# EAGLE design vcf20 (EAGLE 9.5.2)
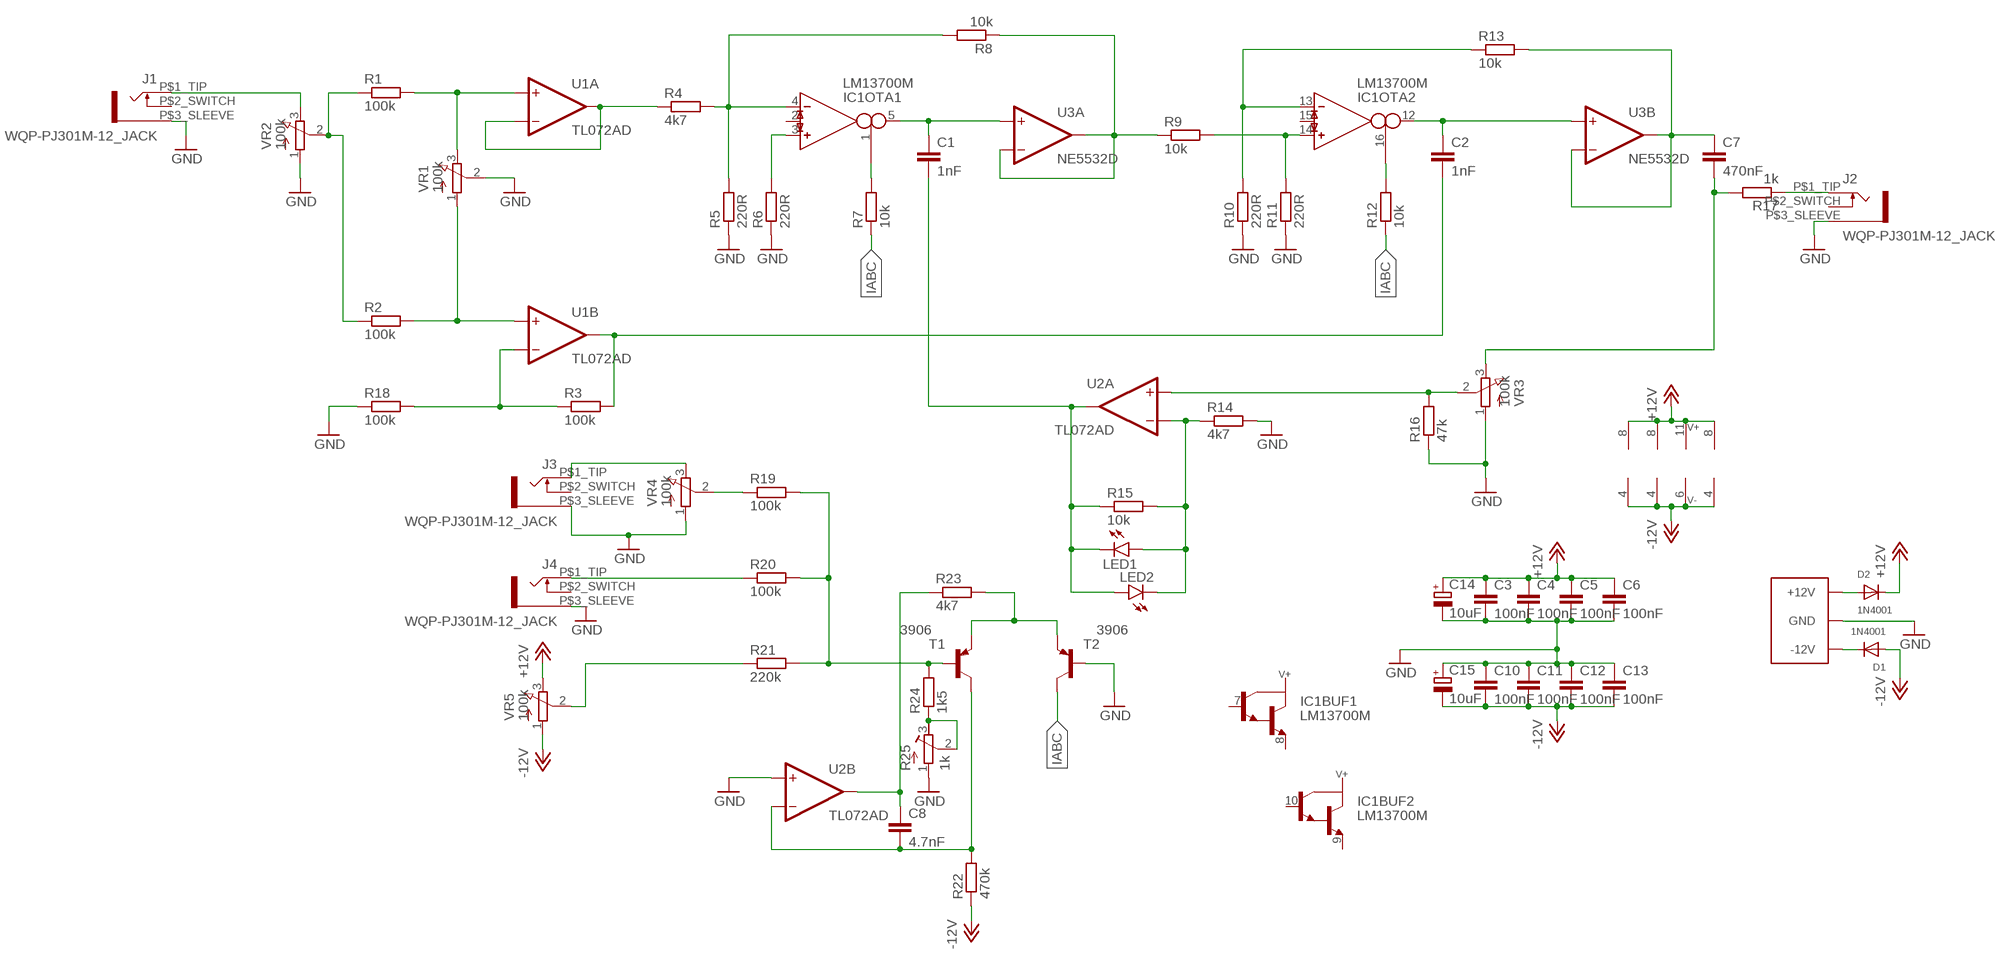
[diagram p0: schematic, sheet 1]

## Parts
C1  1nF  C-EUC0402  [C0402]
C2  1nF  C-EUC0402  [C0402]
C3  100nF  C-EUC0402  [C0402]
C4  100nF  C-EUC0402  [C0402]
C5  100nF  C-EUC0402  [C0402]
C6  100nF  C-EUC0402  [C0402]
C7  470nF  C-EUC0402  [C0402]
C8  4.7nF  C-EUC0402  [C0402]
C9  EURO_POWER_LOCKFAT-LOCK  [EURO_PWR_HEADER_LOCK]
C10  100nF  C-EUC0402  [C0402]
C11  100nF  C-EUC0402  [C0402]
C12  100nF  C-EUC0402  [C0402]
C13  100nF  C-EUC0402  [C0402]
C14  10uF  CPOL-EUC  [PANASONIC_C]
C15  10uF  CPOL-EUC  [PANASONIC_C]
D1  1N4001  DIODESMA  [SMADIODE]
D2  1N4001  DIODESMA  [SMADIODE]
IC1  LM13700M  [SO16]
J1  WQP-PJ301M-12_JACK  [WQP-PJ301M-12_JACK]
J2  WQP-PJ301M-12_JACK  [WQP-PJ301M-12_JACK]
J3  WQP-PJ301M-12_JACK  [WQP-PJ301M-12_JACK]
J4  WQP-PJ301M-12_JACK  [WQP-PJ301M-12_JACK]
LED1  LEDSML0603  [SML0603]
LED2  LEDSML0603  [SML0603]
R1  100k  R-EU_R0402  [R0402]
R2  100k  R-EU_R0402  [R0402]
R3  100k  R-EU_R0402  [R0402]
R4  4k7  R-EU_R0402  [R0402]
R5  220R  R-EU_R0402  [R0402]
R6  220R  R-EU_R0402  [R0402]
R7  10k  R-EU_R0402  [R0402]
R8  10k  R-EU_R0402  [R0402]
R9  10k  R-EU_R0402  [R0402]
R10  220R  R-EU_R0402  [R0402]
R11  220R  R-EU_R0402  [R0402]
R12  10k  R-EU_R0402  [R0402]
R13  10k  R-EU_R0402  [R0402]
R14  4k7  R-EU_R0402  [R0402]
R15  10k  R-EU_R0402  [R0402]
R16  47k  R-EU_R0402  [R0402]
R17  1k  R-EU_R0402  [R0402]
R18  100k  R-EU_R0402  [R0402]
R19  100k  R-EU_R0402  [R0402]
R20  100k  R-EU_R0402  [R0402]
R21  220k  R-EU_R0402  [R0402]
R22  470k  R-EU_R0402  [R0402]
R23  4k7  R-EU_R0402  [R0402]
R24  1k5  R-EU_R0402  [R0402]
R25  1k  R-TRIMM64W  [RTRIM64W]
T1  3906  MMBT3906LT1-PNP-SOT23-BEC  [SOT23-BEC]
T2  3906  MMBT3906LT1-PNP-SOT23-BEC  [SOT23-BEC]
U1  TL072AD  [SOIC8]
U2  TL072AD  [SOIC8]
U3  NE5532D  [SOIC8]
VR1  100k  9MM_SNAP-IN_POT_  [9MM_SNAP-IN_POT]
VR2  100k  9MM_SNAP-IN_POT_  [9MM_SNAP-IN_POT]
VR3  100k  9MM_SNAP-IN_POT_  [9MM_SNAP-IN_POT]
VR4  100k  9MM_SNAP-IN_POT_  [9MM_SNAP-IN_POT]
VR5  100k  9MM_SNAP-IN_POT_  [9MM_SNAP-IN_POT]

## Nets
+12V [power]: C3.1 C4.1 C5.1 C6.1 C14.+ D2.C IC1.11(SUPPLY:V+) U1.8(P:V+) U2.8(P:V+) U3.8(P:V+) VR5.3(E)
-12V [power]: C10.2 C11.2 C12.2 C13.2 C15.- D1.A IC1.6(SUPPLY:V-) R22.1 U1.4(P:V-) U2.4(P:V-) U3.4(P:V-) VR5.1(A)
GND [power]: C3.2 C4.2 C5.2 C6.2 C9.GND1(GND) C9.GND2(GND) C9.GND3(GND) C9.GND4(GND) C9.GND5(GND) C9.GND6(GND) C10.1 C11.1 C12.1 C13.1 C14.- C15.+ J1.P$3_SLEEVE J2.P$3_SLEEVE J3.P$3_SLEEVE J4.P$3_SLEEVE R5.1 R6.1 R10.1 R11.1 R14.2 R16.1 R18.1 R25.1(A) T2.B U2.5(B:+IN) VR1.2(S) VR2.1(A) VR3.1(A) VR4.1(A)
IABC: R7.1 R12.1 T2.C
N$1: IC1.4(OTA1:IN_N) R4.2 R5.2 R8.2
N$2: IC1.3(OTA1:IN_P) R6.2
N$3: IC1.1(OTA1:I_BIAS) R7.2
N$4: IC1.14(OTA2:IN_P) R9.2 R11.2
N$5: IC1.16(OTA2:I_BIAS) R12.2
N$6: IC1.13(OTA2:IN_N) R10.2 R13.1
N$7: R8.1 R9.1 U3.1(A:OUT) U3.2(A:-IN)
N$8: C1.1 IC1.5(OTA1:OUT) U3.3(A:+IN)
N$9: R3.1 R18.2 U1.6(B:-IN)
N$10: C7.1 R13.2 U3.6(B:-IN) U3.7(B:OUT)
N$11: C2.1 IC1.12(OTA2:OUT) U3.5(B:+IN)
N$12: C2.2 R3.2 U1.7(B:OUT)
N$13: R1.2 U1.3(A:+IN) VR1.3(E)
N$14: R2.2 U1.5(B:+IN) VR1.1(A)
N$15: C7.2 R17.2 VR3.3(E)
N$16: R4.1 U1.1(A:OUT) U1.2(A:-IN)
N$17: R1.1 R2.1 VR2.2(S)
N$18: LED1.A LED2.C R14.1 R15.2 U2.2(A:-IN)
N$19: J1.P$1_TIP VR2.3(E)
N$20: R16.2 U2.3(A:+IN) VR3.2(S)
N$21: C1.2 LED1.C LED2.A R15.1 U2.1(A:OUT)
N$22: J2.P$1_TIP R17.1
N$23: R24.1 R25.2(S) R25.3(E)
N$24: C8.2 R22.2 T1.C U2.6(B:-IN)
N$25: J3.P$1_TIP VR4.3(E)
N$26: J4.P$1_TIP R20.1
N$27: R19.1 VR4.2(S)
N$28: R21.1 VR5.2(S)
N$29: R19.2 R20.2 R21.2 R24.2 T1.B
N$30 [power]: C9.POS1(+12V) C9.POS2(+12V) D2.A
N$31: R23.2 T1.E T2.E
N$32: C8.1 R23.1 U2.7(B:OUT)
N$33 [power]: C9.NEG1(-12V) C9.NEG2(-12V) D1.C
Unconnected: IC1.2(OTA1:I_DIODE) IC1.7(BUF1:B) IC1.8(BUF1:E) IC1.9(BUF2:E) IC1.10(BUF2:B) IC1.15(OTA2:I_DIODE) J1.P$2_SWITCH J2.P$2_SWITCH J3.P$2_SWITCH J4.P$2_SWITCH

## Library data of the parts
C1-C8 C10-C13 = jhbruhn-cr:C-EU: CAPACITOR, European symbol; SPICEPREFIX: C
C9 = jhbruhn-physical:EURO_POWER_LOCK
C14 C15 = rcl:CPOL-EU: POLARIZED CAPACITOR, European symbol; SPICEPREFIX: C
D1 D2 = adafruit:DIODE: Diode SMADIODE - SMA Surface Mount Package 20V 1A Schottky Diode Digikey: 641-1014-6-ND DO-1N4148 - Through Hole Small Current Diode SOD-123 20V 1 A (.5mV Vf) Schottky Diode - Digikey: MBRX120TPMSCT-ND SOD-323 10V 570mA (.38mV Vf, 3ns) Schottky Diode - Digikey: ZLLS410CT-ND SOD-523 30V 30mA Schottky Diode (RB751S-40TE61) - Digikey: RB751S-40TE61CT-ND SOT23-R/W - SOT23 Package (R = Solder Paste/Reflow Ovens, W = Hand-Soldering) BAT54Film 40V 300mA - Digikey: 497-7162-1-ND
IC1 = jhbruhn-ota:LM13700: Dual OTA with buffers
J1-J4 = jhbruhn-physical:WQP-PJ301M-12_JACK
LED1 LED2 = led:LED: LED OSRAM: - CHIPLED LG R971, LG N971, LY N971, LG Q971, LY Q971, LO R971, LY R971 LH N974, LH R974 LS Q976, LO Q976, LY Q976 LO Q996 - Hyper CHIPLED LW Q18S LB Q993, LB Q99A, LB R99A - SideLED LS A670, LO A670, LY A670, LG A670, LP A670 LB A673, LV A673, LT A673, LW A673 LH A674 LY A675 LS A676, LA A676, LO A676, LY A676, LW A676 LS A679, LY A679, LG A679 - Hyper Micro SIDELED® LS Y876, LA Y876, LO Y876, LY Y876 LT Y87S - SmartLED LW L88C, LW L88S LB L89C, LB L89S, LG L890 LS L89K, LO L89K, LY L89K LS L896, LA L896, LO L896, LY L896 - TOPLED LS T670, LO T670, LY T670, LG T670, LP T670 LSG T670, LSP T670, LSY T670, LOP T670, LYG T670 LG T671, LOG T671, LSG T671 LB T673, LV T673, LT T673, LW T673 LH T674 LS T676, LA T676, LO T676, LY T676, LB T676, LH T676, LSB T676, LW T676 LB T67C, LV T67C, LT T67C, LS T67K, LO T67K, LY T67K, LW E67C LS E67B, LA E67B, LO E67B, LY E67B, LB E67C, LV E67C, LT E67C LW T67C LS T679, LY T679, LG T679 LS T770, LO T770, LY T770, LG T770, LP T770 LB T773, LV T773, LT T773, LW T773 LH T774 LS E675, LA E675, LY E675, LS T675 LS T776, LA T776, LO T776, LY T776, LB T776 LHGB T686 LT T68C, LB T68C - Hyper Mini TOPLED® LB M676 - Mini TOPLED Santana® LG M470 LS M47K, LO M47K, LY M47K Source: http://www.osram.convergy.de LUXEON: - LUMILED® LXK2-PW12-R00, LXK2-PW12-S00, LXK2-PW14-U00, LXK2-PW14-V00 LXK2-PM12-R00, LXK2-PM12-S00, LXK2-PM14-U00 LXK2-PE12-Q00, LXK2-PE12-R00, LXK2-PE12-S00, LXK2-PE14-T00, LXK2-PE14-U00 LXK2-PB12-K00, LXK2-PB12-L00, LXK2-PB12-M00, LXK2-PB14-N00, LXK2-PB14-P00, LXK2-PB14-Q00 LXK2-PR12-L00, LXK2-PR12-M00, LXK2-PR14-Q00, LXK2-PR14-R00 LXK2-PD12-Q00, LXK2-PD12-R00, LXK2-PD12-S00 LXK2-PH12-R00, LXK2-PH12-S00 LXK2-PL12-P00, LXK2-PL12-Q00, LXK2-PL12-R00 Source: www.luxeon.com KINGBRIGHT: KA-3528ASYC Source: www.kingbright.com
R1-R24 = jhbruhn-cr:R-EU_: RESISTOR, European symbol; SPICEPREFIX: R
R25 = rcl:R-TRIMM: Trimm resistor; SPICEMODEL: X; SPICEPREFIXL: POT
T1 T2 = transistor:*-PNP-: PNP Transistror
U1 U2 = jhbruhn-opamp:TL072: Generic Dual Op Amp
U3 = jhbruhn-opamp:NE5532: Generic Dual Op Amp
VR1-VR5 = jhbruhn-physical:9MM_SNAP-IN_POT: 9mm vertical snap-in pot, Alpha / Panasonic style

## Net classes
0 default: width 0.254 mm, drill 0.254 mm
1 power: width 0.406 mm

## Board
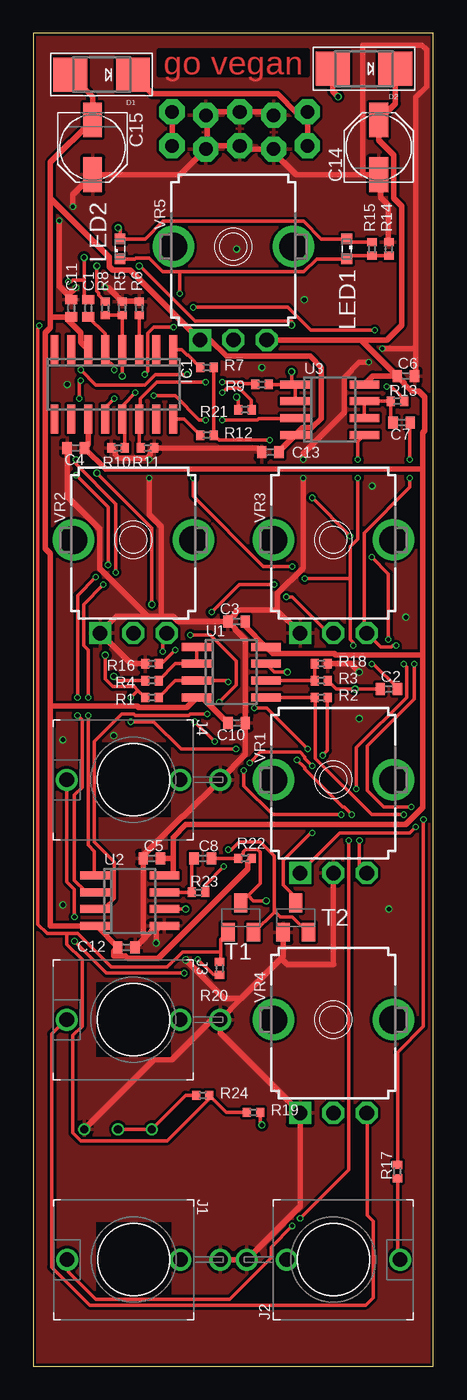
[diagram p1: board, top side]
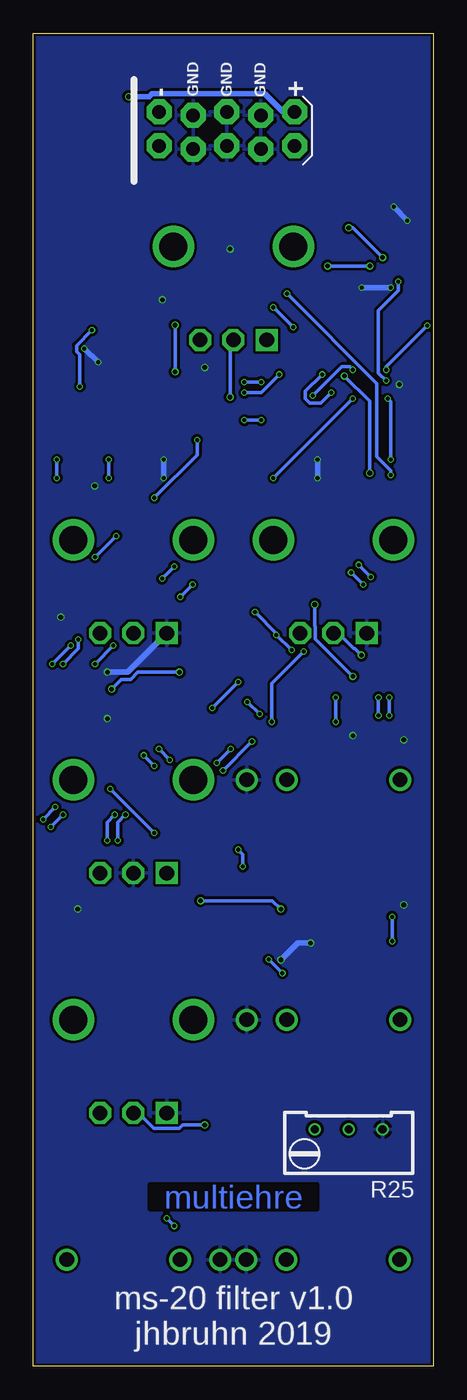
[diagram p2: board, bottom side, seen from below]

Size 30 x 100 mm. Coordinates in mm from the lower left corner, seen from the top.
Outline: 0,0 30,0 30,100 0,100 0,0
Copper layers (1*16): Top 0.035559375mm / dielectric 1.6mm / Bottom 0.035559375mm
Design rules "jlcpcb2layer": minimum track width 10mil, minimum drill 12mil, track to track 8mil, track to pad 8mil, pad to pad 5mil, via to via 10mil, smd to smd 5mil, copper to edge 8mil, drill to drill 6mil, minimum pad ring 5mil, minimum via ring 3mil, stop-mask expansion 2.5mil, vias tented up to drill 0mil, thermal gap 10mil

### Footprints (pad centres in the part's own frame; a part is rotated, then mirrored left to right if it is on the bottom)
C0402 = smd 0.7 x 0.9: 1 -0.65,0; 2 0.65,0
EURO_PWR_HEADER_LOCK = drill 1.016 pad 1.88 octagon: GND1 -2.54,1.143; GND2 -2.54,-1.397; GND3 0,1.397; GND4 0,-1.143; GND5 2.54,1.143; GND6 2.54,-1.397; NEG1 -5.08,1.397; NEG2 -5.08,-1.143; POS1 5.08,1.397; POS2 5.08,-1.143
PANASONIC_C = smd 2.6 x 1.4: + 2.05,0; - -2.05,0
SMADIODE = smd 2.54 x 2.54: A 2.349,0; C -2.349,0
SO16 = smd 0.6 x 2.2: 1 -4.445,-2.6; 2 -3.175,-2.6; 3 -1.905,-2.6; 4 -0.635,-2.6; 5 0.635,-2.6; 6 1.905,-2.6; 7 3.175,-2.6; 8 4.445,-2.6; 9 4.445,2.6; 10 3.175,2.6; 11 1.905,2.6; 12 0.635,2.6; 13 -0.635,2.6; 14 -1.905,2.6; 15 -3.175,2.6; 16 -4.445,2.6
WQP-PJ301M-12_JACK = drill 1.1: P$1_TIP 0,5; P$2_SWITCH 0,-3.5; P$3_SLEEVE 0,-6.5
SML0603 = smd 0.8 x 0.8: A 0.75,0; C -0.75,0
R0402 = smd 0.6 x 0.7: 1 -0.5,0; 2 0.5,0
RTRIM64W = drill 0.61: 1 1.27,-2.54; 2 1.27,0; 3 1.27,2.54
SOT23-BEC = smd 1 x 1.4: B -0.95,-1.1; C 0,1.1; E 0.95,-1.1
SOIC8 = smd 0.6 x 2.2: 1 -1.905,-2.6; 2 -0.635,-2.6; 3 0.635,-2.6; 4 1.905,-2.6; 5 1.905,2.6; 6 0.635,2.6; 7 -0.635,2.6; 8 -1.905,2.6
9MM_SNAP-IN_POT = drill 1.1 square: 1 -2.5,-7 | drill 1.1 octagon: 2 0,-7; 3 2.5,-7 | drill 2.1 pad 2.794: CHASSIS1 -4.5,0; CHASSIS2 4.5,0

### Placement (x,y rotation side)
C1  4.13,79.38 90 top
C2  26.67,50.8 180 top
C3  15.24,55.88 180 top
C4  3.17,68.9 180 top
C5  8.89,38.1 180 top
C6  27.94,74.3 0 top
C7  27.62,70.8 0 top
C8  12.7,38.1 0 top
C9  15.48,92.71 0 bottom
C10  15.24,48.26 180 top
C11  2.86,79.38 270 top
C12  6.99,31.43 180 top
C13  17.78,68.58 0 top
C14  25.91,91.44 90 top
C15  4.45,91.44 270 top
D1  5.13,96.9 180 top
D2  24.81,97.35 180 top
IC1  6.03,73.66 180 top
J1  7.53,8 90 top
J2  22.5,8 270 top
J3  7.5,26 90 top
J4  7.5,44 90 top
LED1  23.5,83.82 270 top
LED2  6.5,83.82 90 top
R1  8.89,50.16 0 top
R2  21.59,50.16 180 top
R3  21.59,51.44 0 top
R4  8.89,51.44 180 top
R5  6.67,79.38 270 top
R6  7.94,79.38 270 top
R7  13.02,74.93 180 top
R8  5.4,79.38 270 top
R9  17.14,73.66 180 top
R10  6.35,68.9 0 top
R11  8.57,68.9 180 top
R12  13.02,69.85 180 top
R13  27.3,72.39 180 top
R14  26.67,83.82 90 top
R15  25.4,83.82 270 top
R16  8.89,52.7 0 top
R17  27.3,14.61 90 top
R18  21.59,52.7 180 top
R19  16.51,19.05 180 top
R20  13.97,29.84 90 top
R21  15.88,71.75 0 top
R22  15.88,38.1 180 top
R23  12.38,35.56 0 top
R24  12.7,20.32 0 top
R25  6.35,16.51 90 bottom
T1  15.56,33.66 0 top
T2  19.68,33.66 0 top
U1  14.85,52.07 270 top
U2  7.22,34.92 270 top
U3  22.23,71.75 270 top
VR1  22.5,44 0 top
VR2  7.5,62 0 top
VR3  22.5,62 0 top
VR4  22.5,26 0 top
VR5  15,84 0 top

### Tracks (layer width: path | path; a pad name or v marks a point on that pad's centre or on a via)
+12V
  Top 0.406: U3.8 25.46,74.3 C6.1 | C6.1 27.83,73.75 27.83,73.68 28.36,73.15 28.91,73.15 29.35,72.71 29.35,70.18 29.21,70.05 29.21,67.31 | 29.21,67.31 29.21,53.34 | 29.21,53.34 22.68,53.34 22.56,53.46 17.96,53.46 U1.8 15.89,55.53 C3.1 | 29.21,53.34 29.21,41.91 27.94,40.64 11.43,40.64 10.48,39.69 10.48,38.1 | 10.48,38.1 10.48,36.83 U2.8 | C5.1 10.48,38.1 | IC1.11 4.13,69.2 C4.1 5.41,67.31 29.21,67.31 | 24.59,77 26.52,77 27.62,78.11 27.62,87.02 27.01,87.63 27.01,90.86 25.91,91.97 C14.+ 27.16,94.74 D2.C | 24.59,77 VR5.3 | C6.1 24.59,77
-12V
  Top 0.406: 1.27,87.63 1.27,90.31 C15.- 4.45,95.23 D1.A | 1.27,87.63 1.27,78.74 | 1.27,78.74 1.28,78.72 2.54,78.72 | 2.54,78.72 C11.2 | IC1.6 3.56,76.82 3.56,77.53 2.54,78.55 2.54,78.72 | 1.27,49.53 1.27,60.95 0.88,61.34 0.88,77.53 1.27,77.92 1.27,78.74 | 1.27,49.53 7.8,49.53 7.92,49.41 11.49,49.41 U1.4 12.69,50.16 C10.2 | 1.27,49.53 1.27,44.51 1.27,43.49 1.27,33.02 U2.4 4.75,33.02 C12.2 6.03,31.13 6.03,30.8 6.89,30.8 7.12,30.58 9.36,30.58 16.08,37.3 16.08,37.81 R22.1 | C13.2 18.43,68.66 U3.4 20.19,70.41 20.89,70.41 21.59,71.11 21.59,74.93 20.75,75.77 14.49,75.77 13.26,77 VR5.1 7.27,82.23 5.96,82.23 5.69,82.5 5.69,83.21 1.27,87.63
GND  (via drill 0.3, 0.35)
  Top 0.406: C9.GND1 17.77,94.11 C9.GND3 13.19,94.11 C9.GND5 13.03,93.73 13.03,91.67 C9.GND6 | C9.GND2 17.78,91.31 | 17.78,91.31 15.73,91.31 C9.GND4 13.19,91.57 C9.GND6 | C9.GND6 11.02,89.39 C15.+ 4.34,89.27 2.97,87.9 v2.97,86.98 | 24.69,89.39 C14.- 26.06,89.27 26.06,87.67 26.63,87.1 26.63,84.35 R14.2 | 24.69,89.39 19.7,89.39 17.78,91.31 | C12.1 8.42,32.22 | 8.42,32.22 9.22,33.02 9.53,33.02 | 9.53,33.02 U2.5 | 8.42,32.22 8.24,32.4 C5.2 8.24,38.31 11.18,41.25 11.25,41.25 J4.P$3_SLEEVE 15.89,45.89 C10.1 15.89,54.51 15.13,55.26 15.13,55.34 C3.2 | J3.P$3_SLEEVE 15.59,27.59 | 15.59,27.59 18.61,30.61 | 18.61,30.61 18.73,30.73 T2.B | VR1.2 22.5,30.2 22.54,30.16 19.05,30.16 18.61,30.61 | J1.P$3_SLEEVE J2.P$3_SLEEVE 20,12 VR4.1 14,25 J3.P$3_SLEEVE | R25.1 9.03,23 10.38,23 13.39,26 J3.P$3_SLEEVE | 15.59,27.59 14.32,27.59 v11.43,30.48 | v9.21,31.75 9.21,32.7 9.53,33.02 | R16.1 7.29,52.7 VR2.1 6.23,56.23 8.57,56.23 | C3.2 10.86,55.88 10.51,56.23 9.6,56.23 | 9.6,56.23 8.57,56.23 | C3.2 15.13,56.42 15.13,56.5 15.37,56.74 18.26,56.74 | VR3.1 18.26,56.74 | R18.1 23.81,52.7 v24.45,52.07 | 8.54,68.14 8.78,68.38 8.78,68.6 R11.1 16.81,68.9 C13.1 | R10.1 6.14,68.6 6.14,68.38 6.38,68.14 8.54,68.14 | C4.2 2.52,65.25 4.96,62.81 4.96,59.84 8.57,56.23 | v8.69,66.64 8.69,63.89 9.6,62.98 9.6,56.23 | v8.69,68.01 8.54,68.14 | R6.1 7.89,79.9 6.74,79.9 R5.1 6.51,80.01 5.6,80.92 v5.37,80.92 | 2.63,80.35 1.94,81.04 v1.94,85.95 | 2.63,80.35 2.86,80.12 C11.1 | 28.69,76.35 28.69,95.21 29.49,96.01 29.49,98.75 29.15,99.1 24.69,99.1 24.69,89.39 | 28.69,76.35 28.69,74.3 C6.2 | 2.63,80.35 v3.2,80.92 | v20.23,66.64 20.23,59.89 18.29,57.95 18.29,56.92 18.26,56.74
  Top 0.406: v20.23,68.01 20.23,68.47 23.32,71.55 23.32,74.18 24.46,75.32 v25.15,75.32 | 28.69,76.35 v26.18,76.35
  Bottom 0.406: v11.43,30.48 10.16,31.75 v9.21,31.75 | v24.45,52.07 22.93,52.07 VR3.1 | v8.69,66.64 v8.69,68.01 | v2.97,86.98 v1.94,85.95 | v3.2,80.92 v5.37,80.92 | v20.23,68.01 v20.23,66.64 | v26.18,76.35 v25.15,75.32
  other vias: 20.32,80.01 15.24,83.82 2.54,73.66 17.14,74.93 25.4,66.04 6.03,47.31 24.45,48.58 26.67,34.29 2.22,46.99 2.22,34.61 27.94,56.2
  pour Top: 0,100.33 0,0 30.48,0 30.48,100.33
  pour Bottom: 0,100.33 0,0 30.48,0 30.48,100.33
IABC  (via drill 0.3)
  Top 0.254: R7.1 R12.1 13.6,69.84 13.95,69.49 v17.72,69.49 | v20.92,40.01 20.8,40.01 18.75,37.95 18.75,36.12 19.66,35.2 19.66,34.86 T2.C | v24.23,43.32 24.23,46.41 28,50.18 28,52.46 v27.77,52.69 | v26.63,54.52 26.63,59.44 v25.38,60.69 | v20.92,65.15 v23.77,62.29
  Bottom 0.254: v24.23,43.32 v20.92,40.01 | v27.77,52.69 26.63,53.84 v26.63,54.52 | v23.77,62.29 v25.38,60.69 | v20.92,65.15 17.72,68.35 v17.72,69.49
N$1  (via drill 0.35)
  Top 0.254: R8.2 R5.2 IC1.4 v6.67,74.3 | R4.2 6.35,51.44 v6.03,51.75 | v8.89,57.15 8.89,62.89 v4.77,67
  Bottom 0.254: v6.03,51.75 8.85,54.56 8.85,55.48 8.89,55.52 v8.89,57.15 | v4.77,67 4.77,72.4 v6.67,74.3
N$2
  Top 0.254: R6.2 IC1.3
N$3
  Top 0.254: R7.2 11.6,75.84 11.54,75.84 11.12,76.26 IC1.1
N$4  (via drill 0.3)
  Top 0.254: R11.2 7.94,69.03 IC1.14 8,71.09 8,72.58 9.26,73.84 v12.92,73.84 | v14.17,73.84 15.66,73.84 15.77,73.72 16.57,73.72 R9.2
  Bottom 0.254: v12.92,73.84 v14.17,73.84
N$5
  Top 0.254: R12.2 11.31,71.06 IC1.16
N$6  (via drill 0.3)
  Top 0.254: R10.2 6.85,70.88 IC1.13 6.74,71.09 6.74,72.12 v7.66,73.04 | v26.52,73.5 26.86,73.5 27.55,72.81 27.55,72.69 27.77,72.47 R13.1 | v25.6,77.72 20.8,77.72 19.09,79.44 v12,79.44 | v10.52,77.95 9.03,77.95 8.57,77.5 8.57,74.64 v8.34,74.41
  Bottom 0.254: v26.52,73.5 26.52,75.89 26.75,76.12 26.75,76.58 v25.6,77.72 | v10.52,77.95 v12,79.44 | v8.34,74.41 9.6,73.15 9.6,72.58 9.26,72.24 8.46,72.24 v7.66,73.04
N$7  (via drill 0.35)
  Top 0.254: R9.1 19.37,73.66 | 19.37,73.66 U3.1 U3.2 | R8.1 4.91,80.36 4.91,80.51 4.76,80.66 v4.76,82.55 | v7.94,82.55 8.01,82.55 12.14,78.42 19.37,78.42 v19.37,78.11 | v19.37,74.61 19.37,73.66
  Bottom 0.254: v4.76,82.55 v7.94,82.55 | v19.37,78.11 v19.37,74.61
N$8  (via drill 0.3)
  Top 0.254: C1.1 5.4,77.45 IC1.5 5.49,76.24 5.49,75.55 6.06,74.98 v6.06,74.75 | v14.17,70.98 16.8,70.98 16.92,71.09 19.55,71.09 U3.3 | v12.92,70.98 12.46,70.98 10.63,72.81 v9.03,72.81
  Bottom 0.254: v12.92,70.98 v14.17,70.98 | v9.03,72.81 6.86,74.98 6.29,74.98 v6.06,74.75
N$9
  Top 0.254: U1.6 R3.1 R18.2
N$10
  Top 0.254: U3.6 U3.7 R13.2 26.8,70.97 C7.1
N$11  (via drill 0.3)
  Top 0.254: v25.38,52.69 25.49,52.69 27.32,50.86 C2.1 | v24,54.06 24,54.29 23.77,54.52 23.77,59.09 | 23.77,59.09 23.77,61.49 24.35,62.06 v24.35,66.64 | v24.35,68.01 24.35,69.38 24.8,69.84 U3.5 | v6.06,72.58 5.49,72.01 5.49,71.09 IC1.12 | v12,66.64 12,65.27 17.26,60.01 v19.43,60.01 | 23.77,59.09 v20.34,59.09
  Bottom 0.254: v24,54.06 v25.38,52.69 | v24.35,68.01 v24.35,66.64 | v12,66.64 v6.06,72.58 | v20.34,59.09 v19.43,60.01
N$12  (via drill 0.35)
  Top 0.254: C2.2 v24.13,50.8 22.73,50.8 R3.2 | U1.7 18.08,52.07 v19.05,52.07
  Bottom 0.254: v19.05,52.07 22.18,52.07 22.71,51.54 23.39,51.54 v24.13,50.8
N$13  (via drill 0.3)
  Top 0.254: R1.2 10.66,51.44 U1.3 14.52,51.44 v14.63,51.32 | v16.57,49.38 17.49,49.38 v20.57,46.29 | v19.77,45.49 20.34,44.92 20.34,44.81 23.2,41.95 23.32,41.95 v23.89,41.38 | v24.46,39.43 24.46,37.49 24.92,37.03 VR1.3
  Bottom 0.254: v16.57,49.38 v14.63,51.32 | v19.77,45.49 v20.57,46.29 | v23.89,41.38 24.46,40.8 v24.46,39.43
N$14  (via drill 0.3)
  Top 0.254: U1.5 R2.2 21.14,50.06 21.14,45.61 25.38,41.38 v27.77,41.38 | v28.69,40.46 28.23,40.01 22.97,40.01 20,37.03 VR1.1
  Bottom 0.254: v28.69,40.46 v27.77,41.38
N$15  (via drill 0.3)
  Top 0.254: v29.26,41.03 29.26,25.49 27.32,23.55 27.32,15.2 R17.2 | v28.35,41.95 26.29,41.95 25.03,43.2 25.03,46.52 28.57,50.06 v28.57,52.69 | v27.2,54.06 26.98,54.06 26.86,53.95 26.06,53.95 25.03,54.98 VR3.3 24.92,55.09 24.8,55.21 24.8,62.52 28.23,65.95 v28.23,66.64 | v28.23,68.01 28.23,70.75 C7.2
  Bottom 0.254: v28.35,41.95 v29.26,41.03 | v27.2,54.06 v28.57,52.69 | v28.23,66.64 v28.23,68.01
N$16
  Top 0.254: U1.1 U1.2 10.66,52.7 R4.1
N$17  (via drill 0.3, 0.35)
  Top 0.254: R1.1 7.85,50.71 | 7.85,50.71 7.58,50.98 5.97,50.98 5.4,51.55 v5.4,53.34 | v21.72,45.83 22.06,46.18 22.06,50.06 R2.1 | v20.92,45.03 20.34,45.61 20.34,45.72 20,46.06 17.03,46.06 v16.23,45.26 | v15.2,46.29 11.09,46.29 9.03,48.35 v7.32,48.35 | 7.85,50.71 v7.32,50.18
  Bottom 0.254: v5.4,53.34 5.9,53.84 5.96,53.84 7.12,55 VR2.2 | v20.92,45.03 v21.72,45.83 | v15.2,46.29 v16.23,45.26 | v7.32,50.18 v7.32,48.35
N$18  (via drill 0.3)
  Top 0.254: LED2.C 7.62,83.07 7.69,83.14 8.69,83.14 9.72,82.11 10.97,82.11 | 10.97,82.11 20.28,82.11 21.24,83.07 LED1.A 23.75,83.32 R15.2 R14.1 | v3.31,48.81 3.66,48.46 3.66,43.43 3.09,42.86 3.09,36.46 3.89,35.66 4.57,35.66 U2.2 | v3.31,50.18 3.31,57.84 v4.69,59.21 | v5.6,60.12 5.6,64.47 v3.2,66.86 | 10.97,82.11 v10.97,80.47
  Bottom 0.254: v3.31,50.18 v3.31,48.81 | v5.6,60.12 v4.69,59.21 | v3.2,66.86 3.2,67.21 4.23,68.24 4.23,73.72 v10.97,80.47
N$19  (via drill 0.3)
  Top 0.254: v19.43,10.52 17.83,8.91 17.83,8.12 14.74,5.03 4.69,5.03 2.63,7.09 2.63,7.89 J1.P$1_TIP | v20,11.09 23.66,14.74 v23.66,39.43 | v23.09,41.38 17.95,41.38 15.77,43.55 v15.77,44.69 | v12.12,48.35 v13.6,46.86 | v9.72,53.61 9.72,54.75 9.94,54.98 VR2.3
  Bottom 0.254: v20,11.09 v19.43,10.52 | v23.66,39.43 23.66,40.8 v23.09,41.38 | v13.6,46.86 v15.77,44.69 | v12.12,48.35 12.12,51.21 v9.72,53.61
N$20  (via drill 0.3)
  Top 0.254: v10.63,53.72 9.72,52.81 9.49,52.81 R16.2 | v11.77,54.86 13.26,54.86 15.2,52.92 15.2,51.09 v13.95,49.84 | v13.03,48.92 11.77,48.92 11.66,48.81 7.66,48.81 7.54,48.92 6.63,48.92 4.57,46.86 4.57,39.32 6.06,37.83 6.06,35.09 5.26,34.29 U2.3 | v18.97,57.72 19.43,57.72 22.06,55.09 22.4,55.09 VR3.2 | v18.06,58.64 15.43,58.64 v13.37,56.58
  Bottom 0.254: v10.63,53.72 v11.77,54.86 11.77,54.98 v13.37,56.58 | v13.03,48.92 v13.95,49.84 | v18.06,58.64 v18.97,57.72
N$21  (via drill 0.3, 0.35)
  Top 0.254: C1.2 3.81,80.34 3.81,81.5 | 3.81,81.5 v3.81,83.19 | v6.35,85.41 6.5,85.26 LED2.A 8.4,84.57 9.72,85.89 20.28,85.89 21.6,84.57 LED1.C 23.75,84.32 R15.1 | v4.12,48.81 4.12,39.09 4.57,38.63 4.57,36.92 U2.1 | v4.12,50.18 4.12,53.72 3.77,54.06 3.77,57.15 v5.26,58.64 | v6.17,59.55 6.17,64.69 3.2,67.67 v3.2,68.01 | v3.43,72.58 3.43,73.84 v3.54,73.95 | v2.63,81.38 2.86,81.38 2.97,81.5 3.81,81.5
  Bottom 0.254: v3.81,83.19 6.03,85.41 v6.35,85.41 | v4.12,50.18 v4.12,48.81 | v6.17,59.55 v5.26,58.64 | v3.2,68.01 3.2,72.35 v3.43,72.58 | v3.54,73.95 4.12,74.52 4.12,79.21 2.63,80.7 v2.63,81.38
N$22
  Top 0.254: R17.1 27.32,14.06 27.32,8.12 27.43,8 J2.P$1_TIP
N$23
  Top 0.254: R25.2 R25.3 11.43,20.32 R24.1
N$24  (via drill 0.35)
  Top 0.254: C8.2 R22.2 15.74,38.47 15.74,38.59 15.94,38.78 16.81,38.78 17,38.59 17,36.2 16.12,35.32 | T1.C 16.12,35.32 | U2.6 v11.43,34.29 | v17.46,34.92 16.51,34.92 16.12,35.32
  Bottom 0.254: v11.43,34.29 12.06,34.92 v17.46,34.92
N$25
  Top 0.254: VR4.3 25.03,18.97 25.03,11.32 25.49,10.86 25.49,5.14 24.92,4.57 4.23,4.57 1.37,7.43 1.37,24.92 2.4,25.95 J3.P$1_TIP
N$26  (via drill 0.3)
  Top 0.254: v12.34,30.52 13.49,29.38 13.95,29.38 R20.1 | v11.32,29.49 5.49,29.49 v3.09,31.89 | v3.09,33.72 3.09,35.78 2.52,36.35 2.52,43.89 J4.P$1_TIP
  Bottom 0.254: v11.32,29.49 v12.34,30.52 | v3.09,33.72 v3.09,31.89
N$27  (via drill 0.35)
  Top 0.254: v17.14,18.1 17.01,18.23 R19.1
  Bottom 0.254: VR4.2 22.12,19 20.96,17.84 19.04,17.84 18.79,18.1 v17.14,18.1
N$28  (via drill 0.35)
  Top 0.254: v15.24,72.71 15.38,72.57 R21.1
  Bottom 0.254: VR5.2 15.24,76.76 v15.24,72.71
N$29  (via drill 0.3)
  Top 0.254: R19.2 14.47,19.05 R24.2 13.26,20.12 10.06,16.92 3.54,16.92 2.97,17.49 2.97,24.8 3.66,25.49 3.66,30.52 2.52,31.66 2.52,32.46 | 14.06,31.09 14.06,32 14.52,32.46 T1.B | 14.06,31.09 14.06,30.4 R20.2 | v14.17,73.04 14.52,73.38 15.43,73.38 16.34,72.47 16.34,71.78 R21.2 | v11.54,74.41 9.14,74.41 8.34,73.61 4.69,73.61 v3.54,74.75 | v0.46,78.07 0.46,77.95 0.34,77.84 0.34,33.15 1.03,32.46 2.52,32.46 | 2.52,32.46 3.31,32.46 5.83,29.95 10.06,29.95 11.2,31.09 14.06,31.09
  Bottom 0.254: v14.17,73.04 12.92,73.04 v11.54,74.41 | v3.54,74.75 3.54,74.98 v0.46,78.07
N$30  (via drill 0.35)
  Top 0.406: 9.93,94.11 C9.POS1 C9.POS2 | v22.86,95.25 22.46,95.65 D2.A
  Bottom 0.406: C9.POS1 11.29,94.11 12.64,95.45 21.12,95.45 21.32,95.25 v22.86,95.25
N$31  (via drill 0.3)
  Top 0.254: v14.29,37.49 12.92,36.12 12.92,35.66 R23.2 | v14.63,38.75 14.86,38.75 15.43,39.32 17.03,39.32 18.06,38.29 18.06,34.06 | 18.06,34.06 16.57,32.58 T1.E | T2.E 20.57,32.58 19.43,33.72 18.52,33.72 18.17,34.06 18.06,34.06
  Bottom 0.254: v14.29,37.49 14.29,38.41 v14.63,38.75
N$32
  Top 0.254: U2.7 R23.1 11.88,37.93 C8.1
N$33
  Top 0.406: C9.NEG2 20.57,91.67 20.57,93.95 20.57,94 | 20.57,94 C9.NEG1 | D1.C 8.92,95.45 18.32,95.45 19.77,94 20.57,94

### Text on the board
Top: go vegan
Bottom: multiehre
bNames: ms-20 filter v1.0 / jhbruhn 2019